# Altium schematic sheet BM83.SchDoc
size 279 x 215 mm; SheetNumber: 3; SheetTotal: 4; SPICEModelCacheLVVEWYVA: <root> / <DocumentId>LVVEWYVA</DocumentId> / <CacheFrame Number="0"> / <Model Name="cap" Kind="MDL"> / <Text>*Default semiconductor capacitor / .MODEL CAP C()</Text> / </Model> / </CacheFrame> / </root>
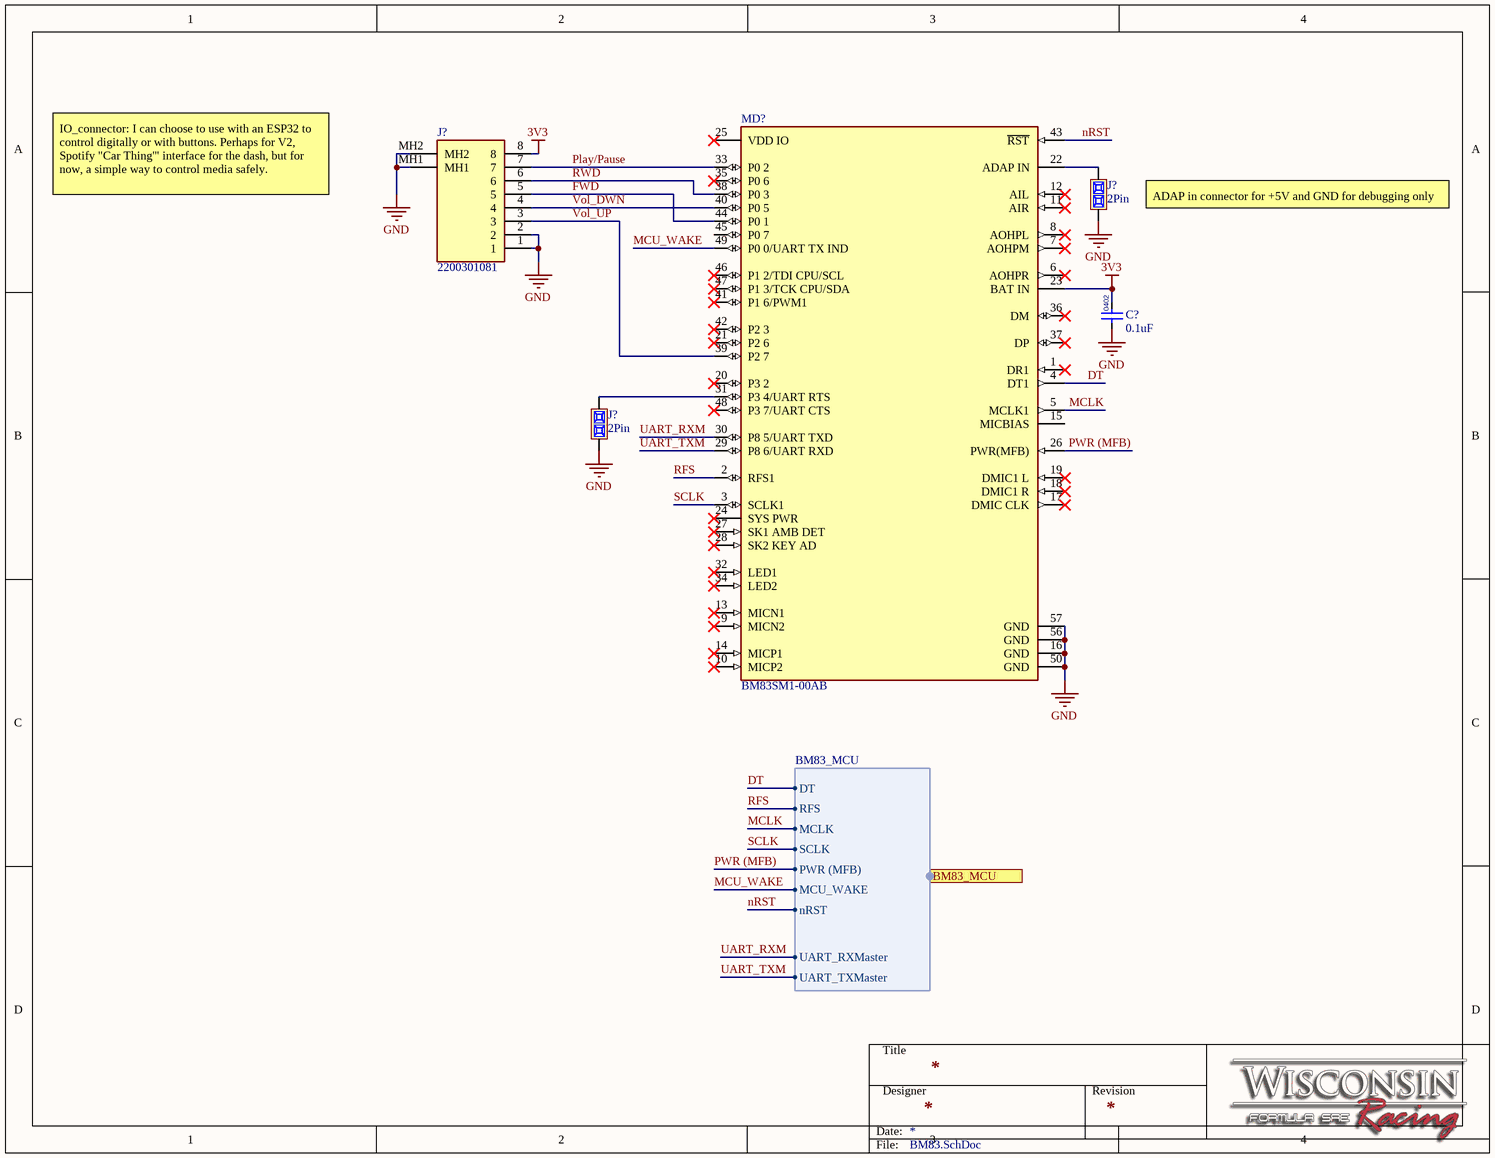
[diagram p0: BM83.SchDoc]

## Parts
(Parts that share a designator on the sheet are numbered #1, #2 ... from top to bottom, then left to right.)
C?  0.1uF  [FP-CC0402-IPC_B]
J?#1  2200301081  [2200301081]
J?#2  2Pin  [2 Pin Male]
J?#3  2Pin  [2 Pin Male]
MD?  BM83SM1-00AB  [FP-BM83SM1-00AB-MFG]

## Ports
BM83_MCU (harness BM83_MCU)

## Harnesses
BM83_MCU: MCLK, MCU_WAKE, SCLK, PWR (MFB), RFS, DT, nRST, UART_TXMaster, UART_RXMaster

## Nets
3V3: C?.2 J?#1.8 MD?.23(BAT_IN)
GND: C?.1 J?#1.1 J?#1.2 J?#1.MH1 J?#1.MH2 J?#2.1 J?#3.1 MD?.16(GND) MD?.50(GND) MD?.56(GND) MD?.57(GND)
DT: MD?.4(DT1) ; port BM83_MCU.DT
FWD: J?#1.5 MD?.44(P0_1)
MCLK: MD?.5(MCLK1) ; port BM83_MCU.MCLK
MCU_WAKE: MD?.49(P0_0/UART_TX_IND) ; port BM83_MCU.MCU_WAKE
nRST: MD?.43(~{RST}) ; port BM83_MCU.nRST
Play/Pause: J?#1.7 MD?.33(P0_2)
PWR (MFB): MD?.26(PWR(MFB)) ; port BM83_MCU.PWR (MFB)
RFS: MD?.2(RFS1) ; port BM83_MCU.RFS
RWD: J?#1.6 MD?.38(P0_3)
SCLK: MD?.3(SCLK1) ; port BM83_MCU.SCLK
UART_RXM: MD?.30(P8_5/UART_TXD) ; port BM83_MCU.UART_RXMaster
UART_TXM: MD?.29(P8_6/UART_RXD) ; port BM83_MCU.UART_TXMaster
Vol_DWN: J?#1.4 MD?.40(P0_5)
Vol_UP: J?#1.3 MD?.39(P2_7)
NetJ?#2_2: J?#2.2 MD?.22(ADAP_IN)
NetJ?#3_2: J?#3.2 MD?.31(P3_4/UART_RTS)

Not connected (* = marked no-connect by the designer): MD? 1(DR1)* 6(AOHPR)* 7(AOHPM)* 8(AOHPL)* 9(MICN2)* 10(MICP2)* 11(AIR)* 12(AIL)* 13(MICN1)* 14(MICP1)* 15(MICBIAS) 17(DMIC_CLK)* 18(DMIC1_R)* 19(DMIC1_L)* 20(P3_2)* 21(P2_6)* 24(SYS_PWR)* 25(VDD_IO)* 27(SK1_AMB_DET)* 28(SK2_KEY_AD)* 32(LED1)* 34(LED2)* 35(P0_6)* 36(DM)* 37(DP)* 41(P1_6/PWM1)* 42(P2_3)* 45(P0_7) 46(P1_2/TDI_CPU/SCL)* 47(P1_3/TCK_CPU/SDA)* 48(P3_7/UART_CTS)*

## Notes on the sheet
- IO_connector: I can choose to use with an ESP32 to control digitally or with buttons. Perhaps for V2, Spotify "Car Thing'" interface for the dash, but for now, a simple way to control media safely.
- (near J?#2) ADAP in connector for +5V and GND for debugging only
- Title
- Designer
- Revision
- Date:
- File:
- (in symbol CMP-Cap-00006-1) 0402

## Library data of the parts
C? = CMP-Cap-00006-1: Ceramic Capacitor, Multilayer, Ceramic, 16V, 10% +Tol, 10% -Tol, X7R, 15% TC, 0.1uF, Surface Mount, 0402; Dielectric: XR7; Capacitance: 100nF; Tolerance: 10%; Voltage Rating: 16V
J?#1 = 2200301081: Connector; Manufacturer_Name: Molex; Datasheet Link: https://www.molex.com/en-us/products/part-detail-pdf/2200301081?display=pdf; Height: 7.3mm; Manufacturer_Part_Number: 2200301081
J?#2 J?#3 = CMP-007-000048-3: Board Connector, 2 Contact(s), 1 Row(s), Male, Straight, 0.1 inch Pitch, Solder Terminal, Black Insulator, Receptacle; MIL Conformance: No; Contact Pattern: RECTANGULAR; Body Breadth: 0.092inch; Dielectric Withstanding Voltage (AC): 750V; Plating Thickness: 100uin; Reliability: COMMERCIAL; Option: General Purpose; Body Depth: 0.09inch; Number of Contacts: 2; Reference Standard: UL; Number Of PCB Rows: 1; Contact Style: SQ PIN-SKT; Mating Information: MULTIPLE MATING PARTS AVAILABLE; Body Length: 0.184inch; Rated Current (Signal): 3A; Insulation Resistance: 5GR; Min Operating Temperature: -65°C; Termination: Solder; Source: Components - 16.09.22 - 20.27.SchLib; RoHS Compliant: No; Filter Feature: No; Insulation Color: Black; Contact Finish - Mating: NOT SPECIFIED; Connector Type: BOARD CONNECTOR; Contact Material: Bronze; Design Item ID: CMP-002-00006-7; Flammability Rating: UL94 V-0; JESD-609 Code: e0; REACH SVHC: No SVHC; Max Operating Temperature: 105°C; Insulation Material: Thermoplastic; Mixed Contacts: No; Number Of Connectors: 1; Number of Rows Loaded: 1; Mount: Board; Body/Shell Style: RECEPTACLE; IEC Conformance: No; Terminal Pitch: 2.54mm; Mating Contact Pitch: 0.1inch; Terminal Length: 0.12inch; Contact Gender: Male; Contact Finish - Termination: TIN LEAD OVER NICKEL; Mounting Style: STRAIGHT; DIN Conformance: No; PCB Contact Pattern: RECTANGULAR
MD? = CMP-06331-000058-1: BLUETOOTH AUDIO MODULE